# EasyEDA schematic Schematic_RetroAV.json
TITLE: RetroAV Shield; REV: 1.0; Date: 2025-07-31; Sheet: 1/1; Drawn By: bslingard; Company: Your Company
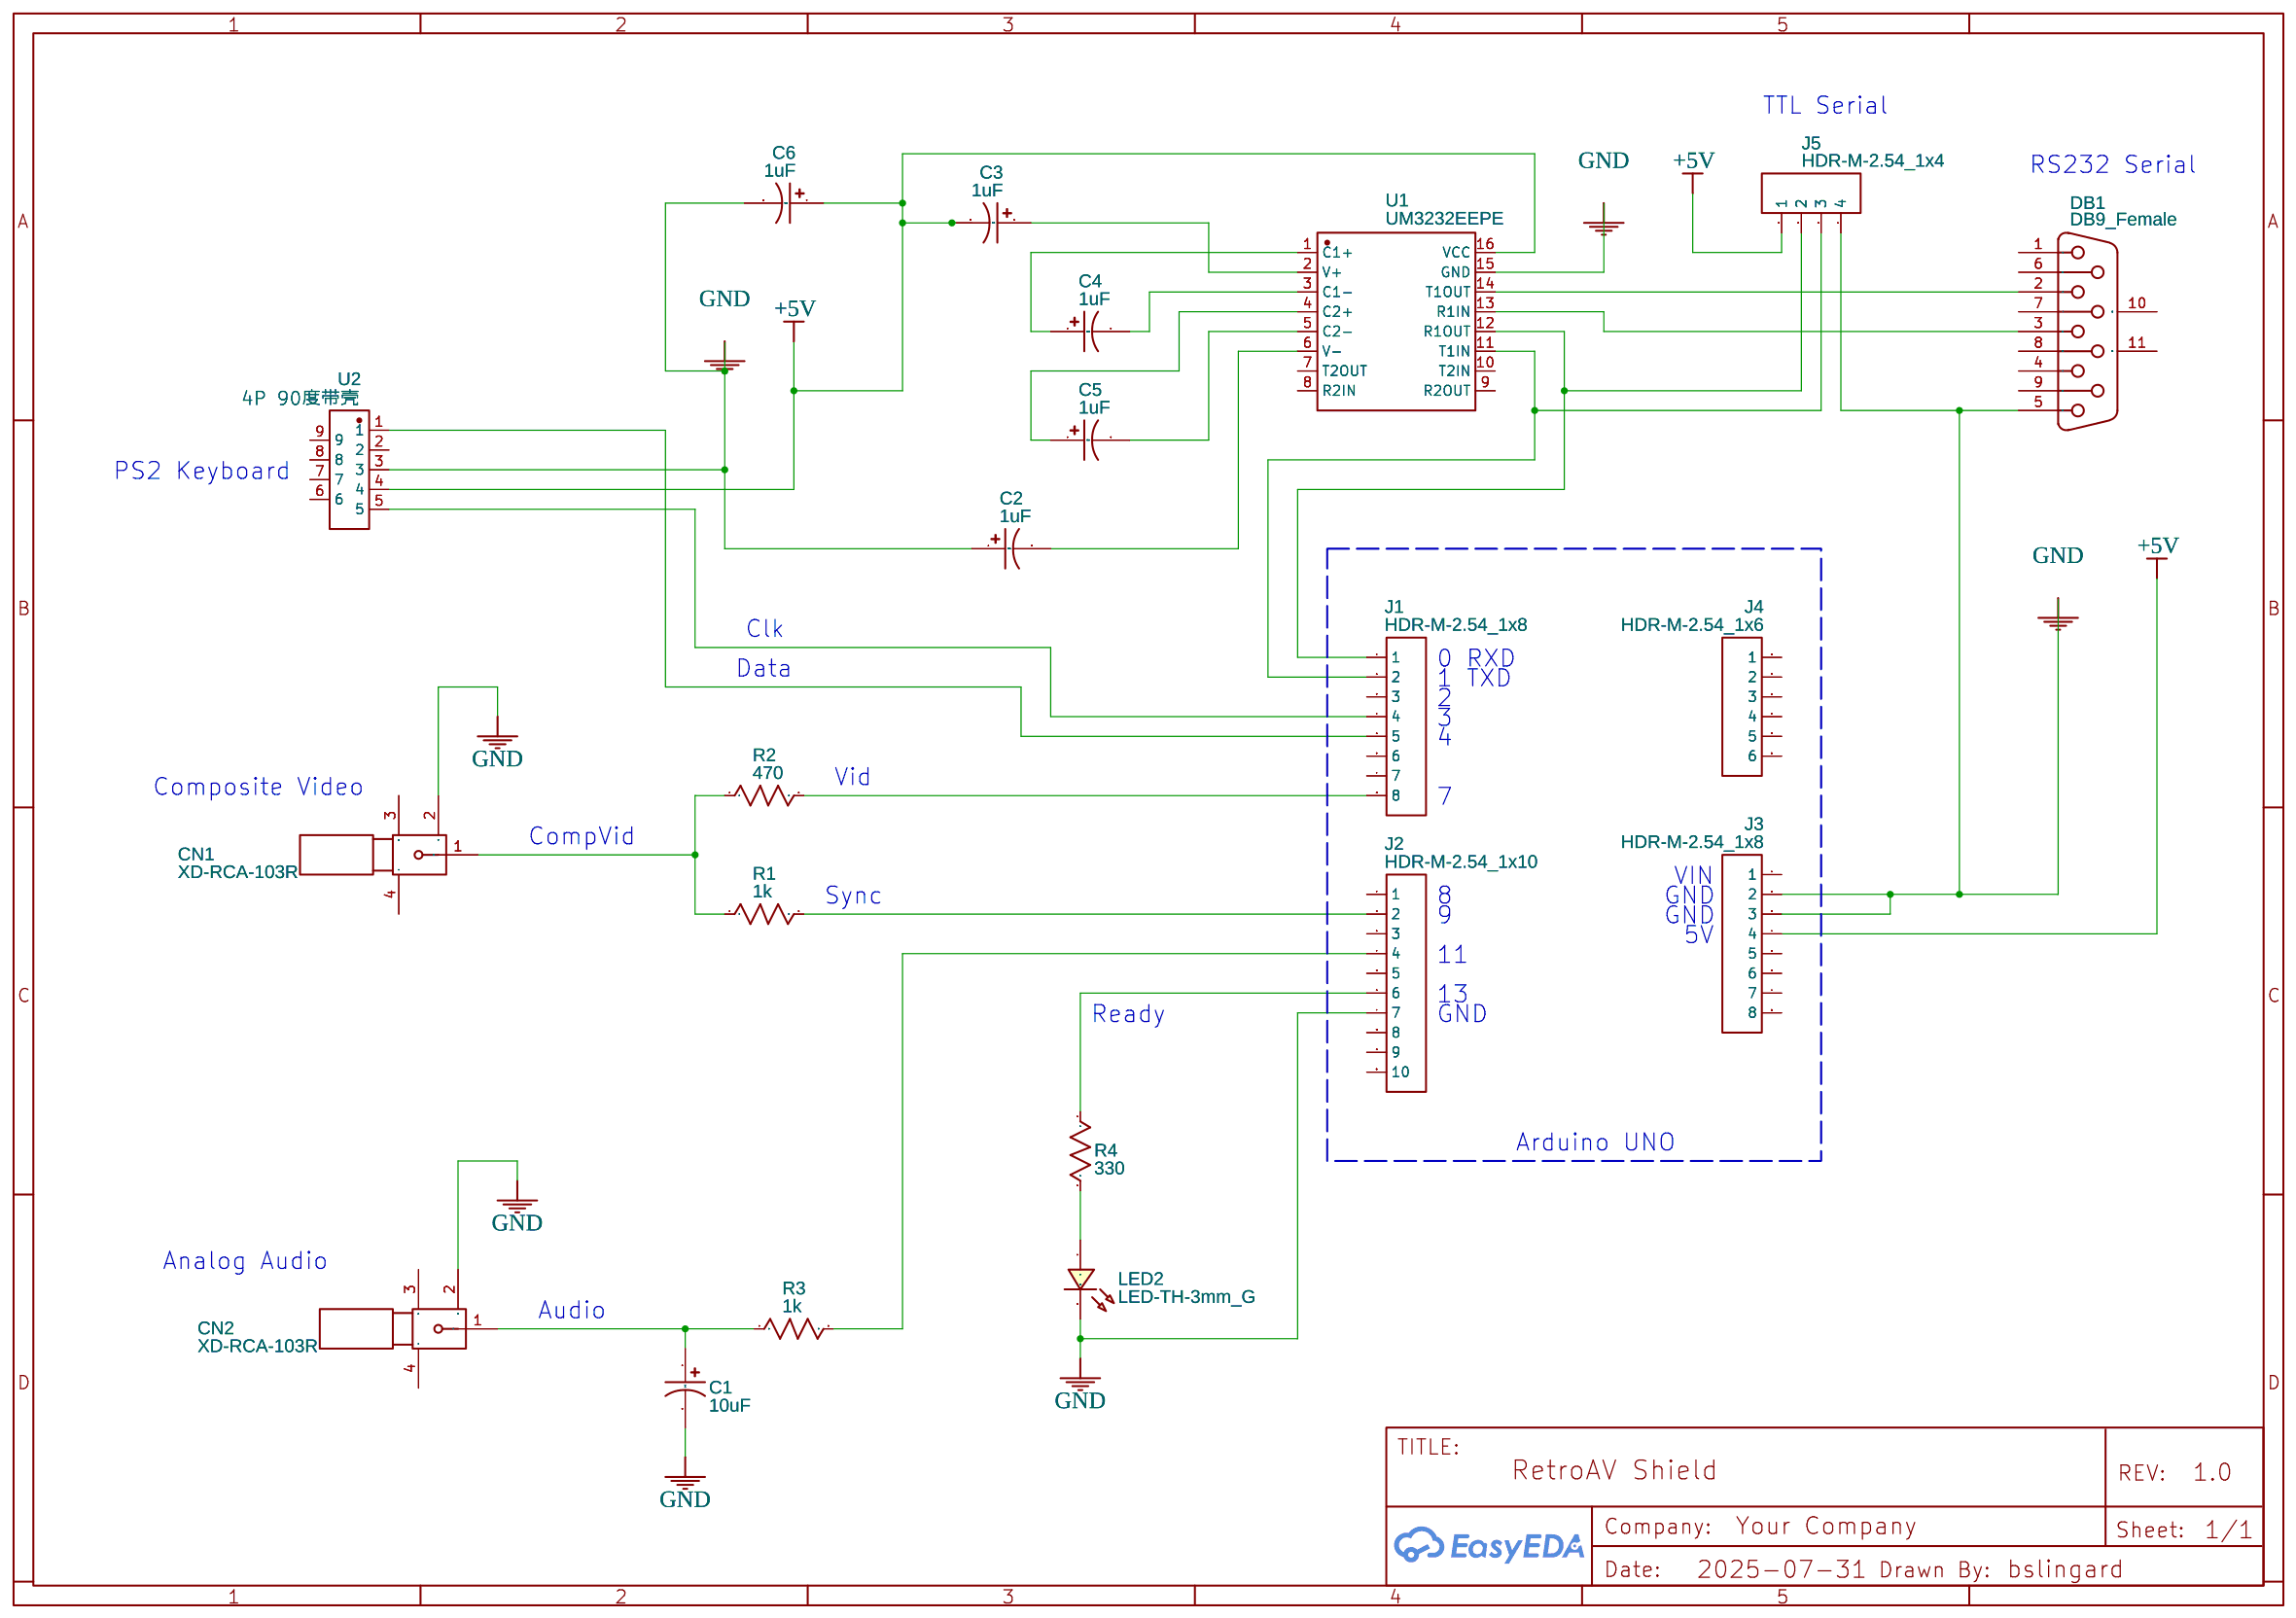
[diagram p0: schematic sheet]

## Parts
C1  10uF  [CAP-D3.0×F1.5]
C2  1uF  [CAP-D3.0×F1.5]
C3  1uF  [CAP-D3.0×F1.5]
C4  1uF  [CAP-D3.0×F1.5]
C5  1uF  [CAP-D3.0×F1.5]
C6  1uF  [CAP-D3.0×F1.5]
CN1  XD-RCA-103R  [CONN-TH_XD-RCA-103R]
CN2  XD-RCA-103R  [CONN-TH_XD-RCA-103R]
DB1  DB9_Female  [DSUB-TH_DMR-9S]
J1  HDR-M-2.54_1x8  [HDR-M-2.54_1X8]
J2  HDR-M-2.54_1x10  [HDR-M-2.54_1X10]
J3  HDR-M-2.54_1x8  [HDR-M-2.54_1X8]
J4  HDR-M-2.54_1x6  [HDR-M-2.54_1X6]
J5  HDR-M-2.54_1x4  [HDR-M-2.54_1X4]
LED2  LED-TH-3mm_G  [LED-TH_BD3.0_GREEN]
R1  1k  [R_AXIAL-1.2]
R2  470  [R_AXIAL-1.2]
R3  1k  [R_AXIAL-1.2]
R4  330  [R_AXIAL-1.2]
U1  UM3232EEPE  [DIP-16_L19.2-W6.6-P2.54-LS7.6-BL]
U2  4P 90度带壳  [PS2-TH_C2874846]

## Library data of the parts
C1-C6 = CE_TH_D3.0×F1.5_US: Contributor: LCEDA_Lib
CN1 CN2 = XD-RCA-103R: Supplier: LCSC; Supplier Part: C47118013; Manufacturer: LX(连欣科技); Contributor: lcsc; JLCPCB Part Class: Extended Part
DB1 = DB9_Female: Supplier Part: C141882; Supplier: LCSC; Manufacturer: Ckmtw(灿科盟); Contributor: LCEDA_Lib
J1 J3 = HDR-M-2.54_1x8: Supplier Part: C190820; Supplier: LCSC; Contributor: LCEDA_Lib
J2 = HDR-M-2.54_1x10: Supplier Part: C57369; Supplier: LCSC; Contributor: LCEDA_Lib
J4 = HDR-M-2.54_1x6: Supplier Part: C190819; Supplier: LCSC; Contributor: LCEDA_Lib
J5 = HDR-M-2.54_1x4: Supplier Part: C124378; Supplier: LCSC; Contributor: LCEDA_Lib
LED2 = LED-TH-3mm_G: Manufacturer: EVERLIGHT(台湾亿光); Manufacturer Part: 204-10SYGD/S530-E3; Supplier Part: C85161; Contributor: LCEDA_Lib
R1 R3 R4 = R_0603_US: Contributor: LCEDA_Lib; Package Display: No
R2 = R_0603_US: Contributor: LCEDA_Lib
U1 = UM3232EEPE: Supplier: LCSC; Supplier Part: C19191890; Manufacturer: Union(英联); Contributor: lcsc
U2 = 4P 90度带壳: Contributor: LCSC; Supplier: LCSC; Supplier Part: C2874846; Manufacturer: null; JLCPCB Part Class: Extended Part

## Nets
+5V: C3.2 C6.1 J3.4 J5.1 U1.16(VCC) U2.4
GND: C1.2 C2.1 C6.2 CN1.2 CN2.2 DB1.5 J2.7 J3.2 J3.3 J5.4 LED2.2 U1.15(GND) U2.3
Net-(C1-1): C1.1 CN2.1 R3.1
Net-(C2-2): C2.2 U1.6(V-)
Net-(C3-1): C3.1 U1.2(V+)
Net-(C4-1): C4.1 U1.1(C1+)
Net-(C4-2): C4.2 U1.3(C1-)
Net-(C5-1): C5.1 U1.4(C2+)
Net-(C5-2): C5.2 U1.5(C2-)
Net-(CN1-1): CN1.1 R1.1 R2.1
Net-(DB1-2): DB1.2 U1.14(T1OUT)
Net-(DB1-3): DB1.3 U1.13(R1IN)
Net-(J1-1): J1.1 J5.2 U1.12(R1OUT)
Net-(J1-2): J1.2 J5.3 U1.11(T1IN)
Net-(J1-4): J1.4 U2.5
Net-(J1-5): J1.5 U2.1
Net-(J1-8): J1.8 R2.2
Net-(J2-2): J2.2 R1.2
Net-(J2-4): J2.4 R3.2
Net-(J2-6): J2.6 R4.1
Net-(LED2-1): LED2.1 R4.2

Not connected (* = marked no-connect by the designer): CN1 3 4; CN2 3 4; DB1 1 4 6 7 8 9 10(MH1) 11(MH2); J1 3 6 7; J2 1 3 5 8 9 10; J3 1 5 6 7 8; J4 1 2 3 4 5 6; U1 7(T2OUT) 8(R2IN) 9(R2OUT) 10(T2IN); U2 2 6 7 8 9

## Notes on the sheet
- TTL Serial
- RS232 Serial
- PS2 Keyboard
- Clk
- 0
- RXD
- Data
- 1
- TXD
- 2
- 3
- 4
- Vid
- Composite Video
- 7
- CompVid
- Sync
- 8
- GND
- VIN
- 9
- GND
- 5V
- 11
- Ready
- 13
- GND
- Arduino UNO
- Analog Audio
- Audio
